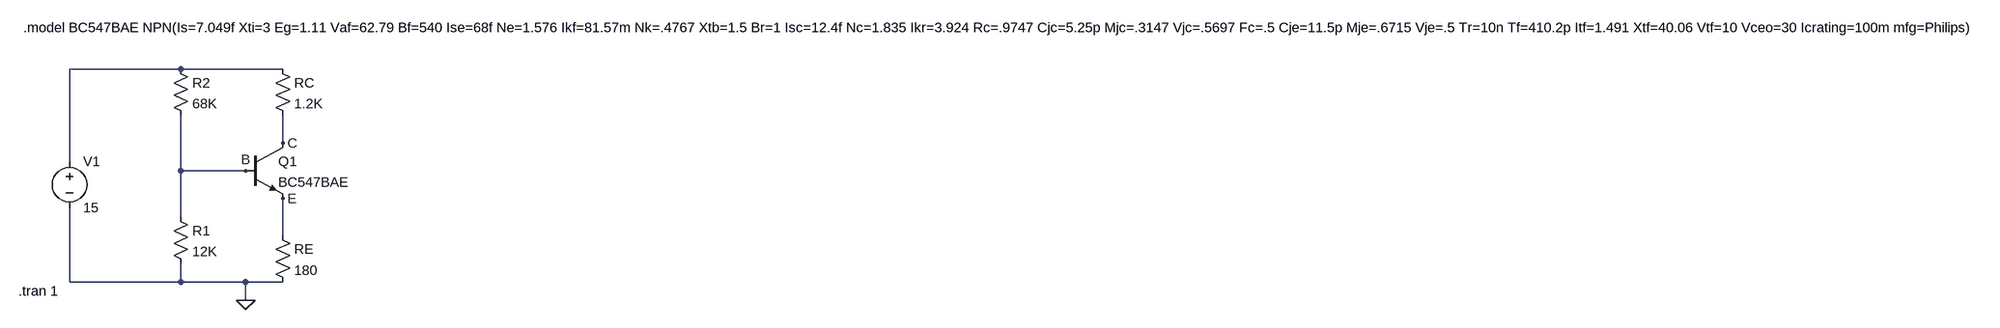
[diagram p0: schematic Sim_Norm.asc]
Sim_Norm.asc, the LTspice schematic file:
Version 4.1
SHEET 1 3988 680
WIRE 496 176 304 176
WIRE 672 176 496 176
WIRE 672 304 672 256
WIRE 304 336 304 176
WIRE 496 352 496 256
WIRE 608 352 496 352
WIRE 496 432 496 352
WIRE 672 464 672 400
WIRE 304 544 304 416
WIRE 496 544 496 512
WIRE 496 544 304 544
WIRE 608 544 496 544
WIRE 672 544 608 544
WIRE 608 576 608 544
FLAG 608 576 0
FLAG 672 304 C
FLAG 672 400 E
FLAG 608 352 B
SYMBOL voltage 304 320 R0
SYMATTR InstName V1
SYMATTR Value 15
SYMBOL res 480 416 R0
SYMATTR InstName R1
SYMATTR Value 12K
SYMBOL res 480 160 R0
SYMATTR InstName R2
SYMATTR Value 68K
SYMBOL res 656 160 R0
SYMATTR InstName RC
SYMATTR Value 1.2K
SYMBOL res 656 448 R0
SYMATTR InstName RE
SYMATTR Value 180
SYMBOL npn 608 304 R0
SYMATTR InstName Q1
SYMATTR Value BC547BAE
TEXT 224 104 Left 2 !.model BC547BAE NPN(Is=7.049f Xti=3 Eg=1.11 Vaf=62.79 Bf=540 Ise=68f Ne=1.576 Ikf=81.57m Nk=.4767 Xtb=1.5 Br=1 Isc=12.4f Nc=1.835 Ikr=3.924 Rc=.9747 Cjc=5.25p Mjc=.3147 Vjc=.5697 Fc=.5 Cje=11.5p Mje=.6715 Vje=.5 Tr=10n Tf=410.2p Itf=1.491 Xtf=40.06 Vtf=10 Vceo=30 Icrating=100m mfg=Philips)
TEXT 216 560 Left 2 !.tran 1

The netlist it stands for:
* Sim_Norm.asc
V1 N001 0 15
R1 B 0 12K
R2 N001 B 68K
RC N001 C 1.2K
RE E 0 180
Q1 C B E 0 BC547BAE
.model NPN NPN
.model PNP PNP
.lib standard.bjt
.model BC547BAE NPN(Is=7.049f Xti=3 Eg=1.11 Vaf=62.79 Bf=540 Ise=68f Ne=1.576 Ikf=81.57m Nk=.4767 Xtb=1.5 Br=1 Isc=12.4f Nc=1.835 Ikr=3.924 Rc=.9747 Cjc=5.25p Mjc=.3147 Vjc=.5697 Fc=.5 Cje=11.5p Mje=.6715 Vje=.5 Tr=10n Tf=410.2p Itf=1.491 Xtf=40.06 Vtf=10 Vceo=30 Icrating=100m mfg=Philips)
.tran 1
.backanno
.end